# Altium schematic sheet Sheet2.SchDoc
size A3
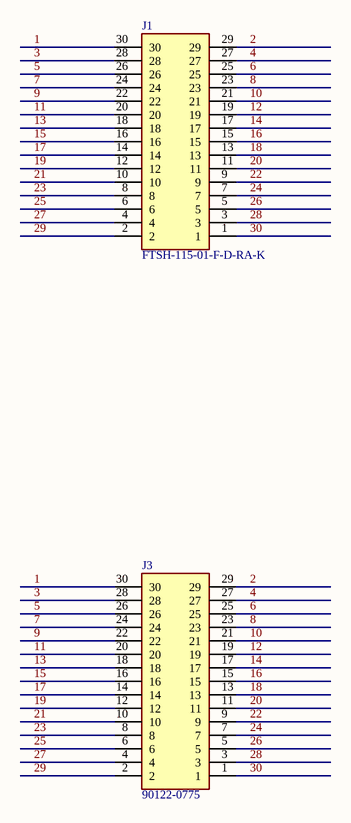
[diagram p0: Sheet2.SchDoc]

## Parts
J1  FTSH-115-01-F-D-RA-K  [FTSH-115-XX-YYY-D-RA-K]
J3  90122-0775  [HDRRA30W65P254_2X15_3802X250X635P]

## Nets
1: J1.30 J3.30
2: J1.29 J3.29
3: J1.28 J3.28
4: J1.27 J3.27
5: J1.26 J3.26
6: J1.25 J3.25
7: J1.24 J3.24
8: J1.23 J3.23
9: J1.22 J3.22
10: J1.21 J3.21
11: J1.20 J3.20
12: J1.19 J3.19
13: J1.18 J3.18
14: J1.17 J3.17
15: J1.16 J3.16
16: J1.15 J3.15
17: J1.14 J3.14
18: J1.13 J3.13
19: J1.12 J3.12
20: J1.11 J3.11
21: J1.10 J3.10
22: J1.9 J3.9
23: J1.8 J3.8
24: J1.7 J3.7
25: J1.6 J3.6
26: J1.5 J3.5
27: J1.4 J3.4
28: J1.3 J3.3
29: J1.2 J3.2
30: J1.1 J3.1

## Library data of the parts
J1 = FTSH-115-01-F-D-RA-K: Connector; Manufacturer_Name: SAMTEC; Datasheet Link: http://suddendocs.samtec.com/prints/ftsh-1xx-xx-xxx-dv-xxx-xxx-mkt.pdf; Manufacturer_Part_Number: FTSH-115-01-F-D-RA-K
J3 = 90122-0775: Connector; Manufacturer_Name: Molex; Datasheet Link: https://rs.componentsearchengine.com/Datasheets/2/90122-0775.pdf; Height: 6.35mm; Manufacturer_Part_Number: 90122-0775; Mouser Part Number: 538-90122-0775; Mouser Price/Stock: https://www.mouser.co.uk/ProductDetail/Molex/90122-0775?qs=kEwmkoUtv7Q3b9FUL9Noug%3D%3D